# EAGLE design pov (EAGLE 5.11)
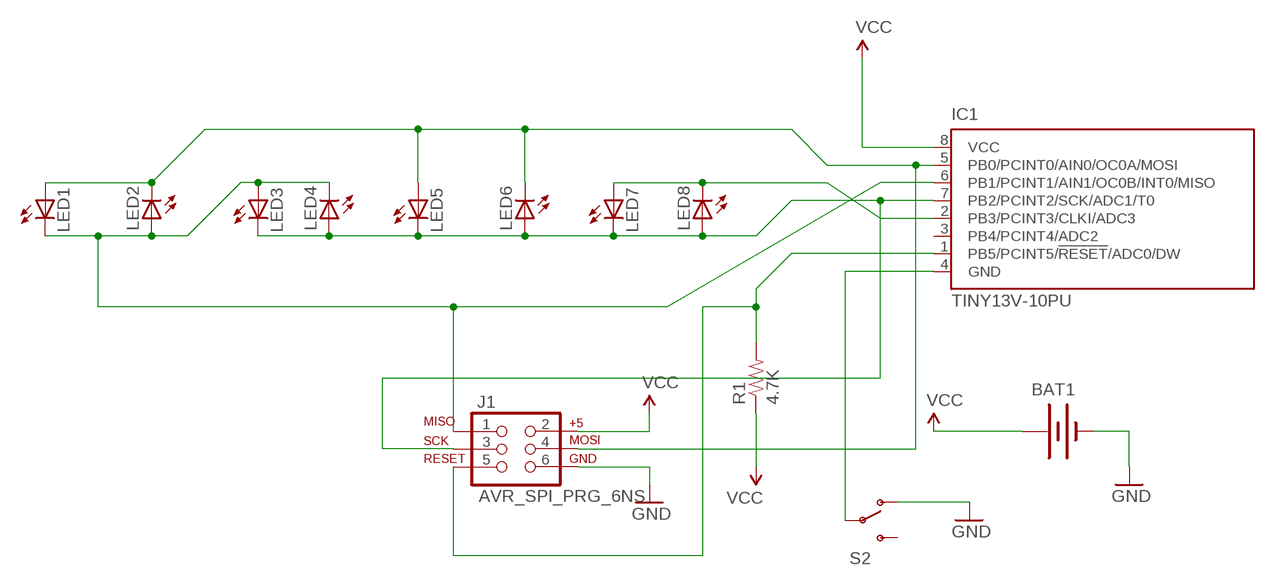
[diagram p0: schematic, sheet 1]

## Parts
BAT1  BATTERY20PTH  [BATTCOM_20MM_PTH]
IC1  TINY13V-10PU  [DIL08]
J1  AVR_SPI_PRG_6NS  [2X3-NS]
LED1  LED5MM  [LED5MM]
LED2  LED5MM  [LED5MM]
LED3  LED5MM  [LED5MM]
LED4  LED5MM  [LED5MM]
LED5  LED5MM  [LED5MM]
LED6  LED5MM  [LED5MM]
LED7  LED5MM  [LED5MM]
LED8  LED5MM  [LED5MM]
R1  4.7K  RESISTORPTH1  [AXIAL-0.3]
S2  SWITCH-SPSTPTH  [SWITCH-SPDT]

## Nets
GND: BAT1.2(-) J1.6 S2.1(O)
N$1: IC1.1(PB5/PCINT5/!RESET!/ADC0/DW) J1.5 R1.P$2
N$2: IC1.7(PB2/PCINT2/SCK/ADC1/T0) J1.3 LED3.K(C) LED4.A LED5.K(C) LED6.A LED7.K(C) LED8.A
N$3: IC1.2(PB3/PCINT3/CLKI/ADC3) LED7.A LED8.K(C)
N$4: IC1.4(GND) S2.2(P)
N$5: IC1.5(PB0/PCINT0/AIN0/OC0A/MOSI) J1.4 LED1.A LED2.K(C) LED5.A LED6.K(C)
N$7: IC1.6(PB1/PCINT1/AIN1/OC0B/INT0/MISO) J1.1 LED1.K(C) LED2.A LED3.A LED4.K(C)
VCC: BAT1.1(+) IC1.8(VCC) J1.2 R1.P$1
Unconnected: IC1.3(PB4/PCINT4/ADC2) S2.3(S)

## Library data of the parts
BAT1 = SparkFun:BATTERY: Battery Holders Various common sizes : AA, AAA, 20mm coin cell and 12mm coin cell.
IC1 = atmel:TINY13: 8-bit AVR Microcontroller with 1K Bytes In-System Programmable Flash Source: http://www.atmel.com/dyn/resources/prod_documents/2535S.pdf; MPN: ATTINY13V-10PU; OC_FARNELL: 9171576; OC_NEWARK: 96K6523
J1 = SparkFun:AVR_SPI_PRG_6: AVR ISP 6 Pin This is the reduced ISP connector for AVR programming. Common on Arduino. This footprint will take up less PCB space and can be used with a 10-pin to 6-pin adapter such as SKU: BOB-08508
LED1-LED8 = led:LED: LED OSRAM: - CHIPLED LG R971, LG N971, LY N971, LG Q971, LY Q971, LO R971, LY R971 LH N974, LH R974 LS Q976, LO Q976, LY Q976 LO Q996 - Hyper CHIPLED LW Q18S LB Q993, LB Q99A, LB R99A - SideLED LS A670, LO A670, LY A670, LG A670, LP A670 LB A673, LV A673, LT A673, LW A673 LH A674 LY A675 LS A676, LA A676, LO A676, LY A676, LW A676 LS A679, LY A679, LG A679 - Hyper Micro SIDELED® LS Y876, LA Y876, LO Y876, LY Y876 LT Y87S - SmartLED LW L88C, LW L88S LB L89C, LB L89S, LG L890 LS L89K, LO L89K, LY L89K LS L896, LA L896, LO L896, LY L896 - TOPLED LS T670, LO T670, LY T670, LG T670, LP T670 LSG T670, LSP T670, LSY T670, LOP T670, LYG T670 LG T671, LOG T671, LSG T671 LB T673, LV T673, LT T673, LW T673 LH T674 LS T676, LA T676, LO T676, LY T676, LB T676, LH T676, LSB T676, LW T676 LB T67C, LV T67C, LT T67C, LS T67K, LO T67K, LY T67K, LW E67C LS E67B, LA E67B, LO E67B, LY E67B, LB E67C, LV E67C, LT E67C LW T67C LS T679, LY T679, LG T679 LS T770, LO T770, LY T770, LG T770, LP T770 LB T773, LV T773, LT T773, LW T773 LH T774 LS E675, LA E675, LY E675, LS T675 LS T776, LA T776, LO T776, LY T776, LB T776 LHGB T686 LT T68C, LB T68C - Hyper Mini TOPLED® LB M676 - Mini TOPLED Santana® LG M470 LS M47K, LO M47K, LY M47K Source: http://www.osram.convergy.de LUXEON: - LUMILED® LXK2-PW12-R00, LXK2-PW12-S00, LXK2-PW14-U00, LXK2-PW14-V00 LXK2-PM12-R00, LXK2-PM12-S00, LXK2-PM14-U00 LXK2-PE12-Q00, LXK2-PE12-R00, LXK2-PE12-S00, LXK2-PE14-T00, LXK2-PE14-U00 LXK2-PB12-K00, LXK2-PB12-L00, LXK2-PB12-M00, LXK2-PB14-N00, LXK2-PB14-P00, LXK2-PB14-Q00 LXK2-PR12-L00, LXK2-PR12-M00, LXK2-PR14-Q00, LXK2-PR14-R00 LXK2-PD12-Q00, LXK2-PD12-R00, LXK2-PD12-S00 LXK2-PH12-R00, LXK2-PH12-S00 LXK2-PL12-P00, LXK2-PL12-Q00, LXK2-PL12-R00 Source: www.luxeon.com KINGBRIGHT: KA-3528ASYC Source: www.kingbright.com
R1 = SparkFun:RESISTOR: Resistor Basic schematic elements and footprints for 0603, 1206, and PTH 1/10th watt (small) resistors.
S2 = SparkFun:SWITCH-SPST: SPST Switch Simple slide switch. Spark Fun Electronics SKU : COM-00102

## Net classes
0 default: width 0.305 mm, clearance 0.203 mm

## Board
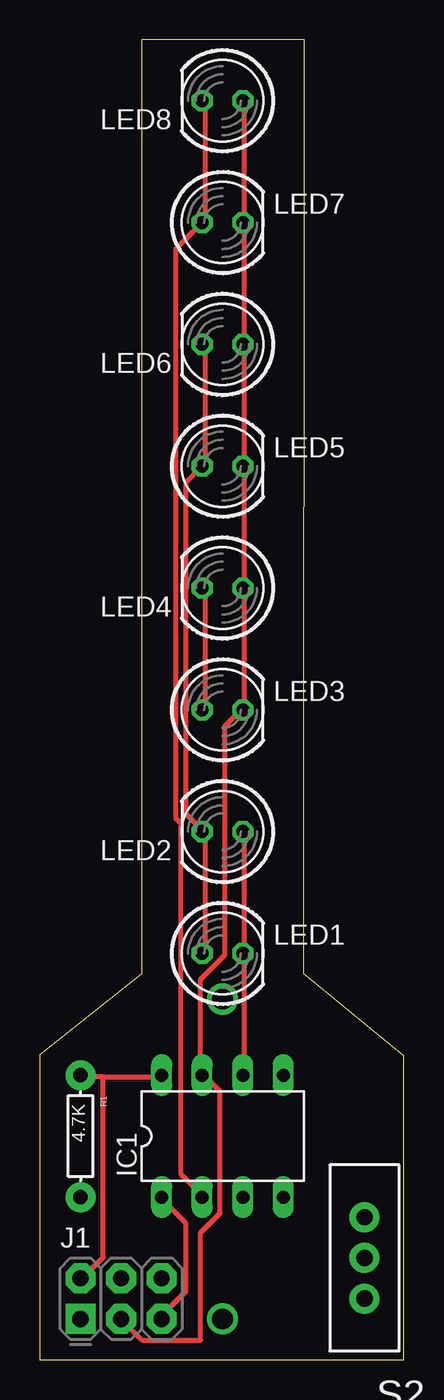
[diagram p1: board, top side]
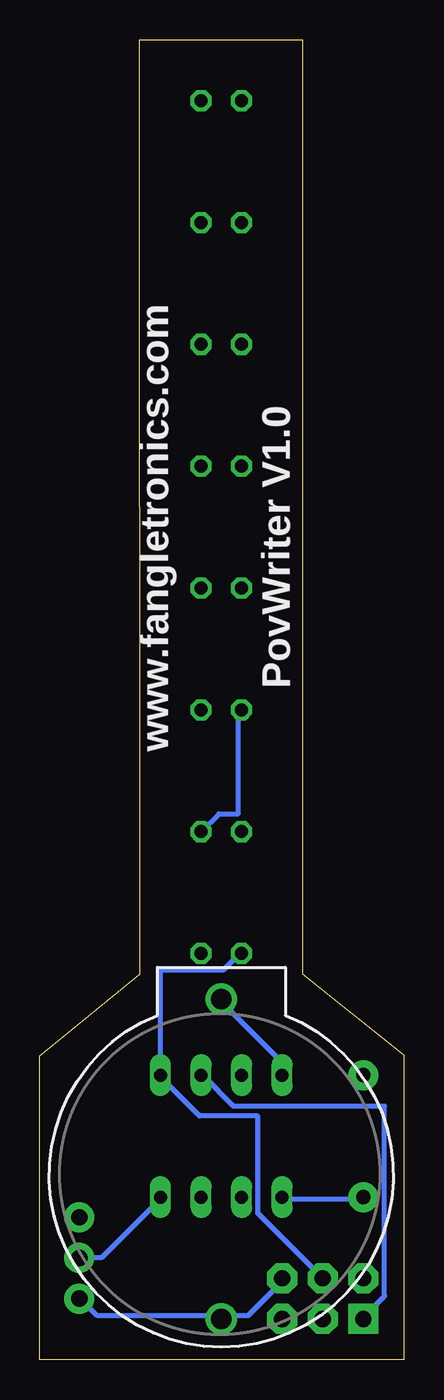
[diagram p2: board, bottom side, seen from below]

Size 22.78 x 82.54 mm. Coordinates in mm from the lower left corner, seen from the top.
Outline: 0,0 22.78,0 22.78,19 16.51,24.13 16.56,82.54 6.35,82.54 6.35,24.13 0,19.05 0,0
Copper layers (1*16): Top 0.035mm / dielectric 1.5mm / Bottom 0.035mm
Design rules "default": minimum track width 10mil, minimum drill 24mil, track to track 8mil, track to pad 8mil, pad to pad 8mil, via to via 8mil, smd to smd 8mil, copper to edge 40mil, drill to drill 8mil, minimum pad ring 10mil, minimum via ring 8mil, stop-mask expansion 4mil, vias tented up to drill 0mil, thermal gap 10mil

### Footprints (pad centres in the part's own frame; a part is rotated, then mirrored left to right if it is on the bottom)
BATTCOM_20MM_PTH = drill 1.3 round: 1 20,0; 2 0,0
DIL08 = drill 0.813 long: 1 -3.81,-3.81; 2 -1.27,-3.81; 3 1.27,-3.81; 4 3.81,-3.81; 5 3.81,3.81; 6 1.27,3.81; 7 -1.27,3.81; 8 -3.81,3.81
2X3-NS = drill 1.016 pad 1.88 square: 1 -2.54,-1.27 | drill 1.016 pad 1.88 octagon: 2 -2.54,1.27; 3 0,-1.27; 4 0,1.27; 5 2.54,-1.27; 6 2.54,1.27
LED5MM = drill 0.813 octagon: A -1.27,0; K 1.27,0
AXIAL-0.3 = drill 0.9 pad 1.88 round: P$1 -3.81,0; P$2 3.81,0
SWITCH-SPDT = drill 1.016 pad 1.88 round: 1 0,2.54; 2 0,0; 3 0,-2.54

### Placement (x,y rotation side)
BAT1  11.43,2.54 90 bottom
IC1  11.43,13.97 0 top
J1  5.08,3.81 0 top
LED1  11.43,25.4 0 top
LED2  11.43,33.02 180 top
LED3  11.43,40.64 0 top
LED4  11.43,48.26 180 top
LED5  11.43,55.88 0 top
LED6  11.43,63.5 180 top
LED7  11.43,71.12 0 top
LED8  11.43,78.74 180 top
R1  2.54,13.97 270 top
S2  20.32,6.35 180 top

### Tracks (layer width: path | path; a pad name or v marks a point on that pad's centre or on a via)
GND
  Bottom 0.305: J1.6 7.62,4.88 9.75,2.74 11.28,2.74 BAT1.2 11.58,2.74 19.2,2.74 20.12,3.66 S2.1
N$1
  Top 0.305: J1.5 7.62,2.74 9.14,4.27 9.14,8.53 7.62,10.06 IC1.1
  Bottom 0.305: IC1.1 7.62,10.06 2.74,10.06 R1.P$2
N$2
  Top 0.305: LED8.A 12.8,78.64 12.8,71.32 LED7.K 12.8,71.02 12.8,63.7 LED6.A 12.8,63.4 12.8,56.08 LED5.K 12.8,55.78 12.8,48.46 LED4.A 12.8,48.16 12.8,40.84 LED3.K 12.5,40.54 11.58,39.62 11.58,25.3 10.06,23.77 10.06,17.98 IC1.7 10.36,17.68 11.28,16.76 11.28,9.14 10.06,7.92 10.06,1.22 6.4,1.22 J1.3
N$3
  Top 0.305: IC1.2 10.06,10.36 8.84,11.58 8.84,33.53 8.53,33.83 8.53,69.49 LED7.A 10.36,71.32 10.36,78.64 LED8.K
N$4
  Bottom 0.305: IC1.4 15.24,10.06 18.9,6.4 20.12,6.4 S2.2
N$5
  Top 0.305: LED6.K 10.36,63.4 10.36,56.08 LED5.A 9.14,54.86 9.14,34.14 10.06,33.22 LED2.K 10.36,32.92 10.36,25.6 LED1.A
  Bottom 0.305: LED1.A 10.36,25.3 11.28,24.38 15.24,24.38 IC1.5 15.24,17.68 12.8,15.24 9.14,15.24 9.14,9.14 J1.4
N$7
  Top 0.305: LED3.A 10.36,40.84 10.36,48.16 LED4.K | IC1.6 12.8,17.98 12.8,25.3 LED1.K 12.8,25.6 12.8,32.92 LED2.A
  Bottom 0.305: J1.1 2.44,2.74 1.22,3.96 1.22,15.85 10.67,15.85 12.5,17.68 IC1.6 | LED3.A 10.36,40.54 10.36,34.14 11.58,34.14 LED2.A
VCC
  Top 0.305: 3.96,17.68 2.74,17.68 R1.P$1 | 3.96,17.68 7.62,17.68 IC1.8 | 3.96,17.68 3.96,6.4 2.74,5.18 J1.2
  Bottom 0.305: BAT1.1 11.28,22.25 7.62,18.59 IC1.8

### Text on the board
bPlace: www.fangletronics.com | PovWriter V1.0